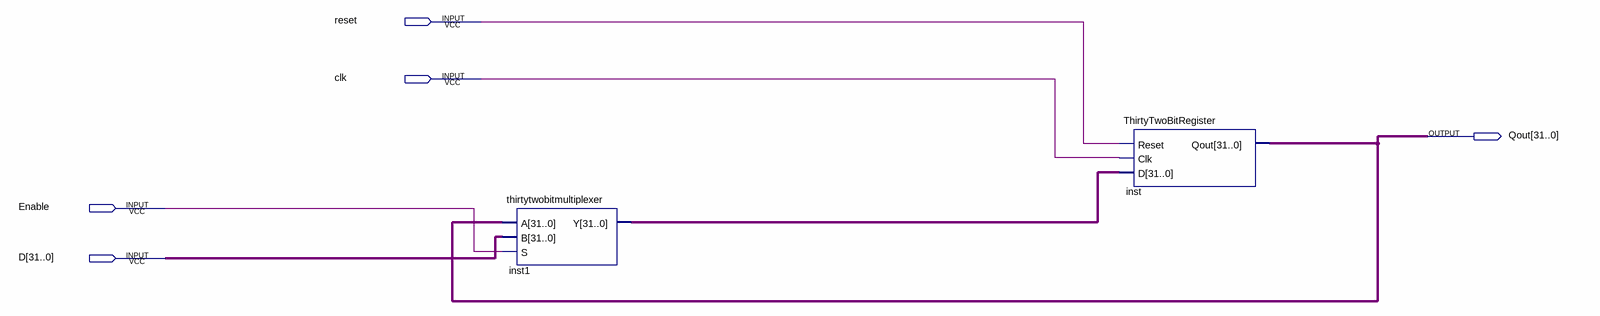
[diagram p0: schematic sheet]
// Quartus schematic thirtytwobitwithenable.bdf as structural Verilog: 2 symbols, 5 pins
module thirtytwobitwithenable (
  input  reset,
  input  clk,
  input  Enable,
  input  [31:0] D,
  output [31:0] Qout
);

  wire [31:0] inst1_y;

  thirtytwobitmultiplexer inst1 (.A(Qout), .B(D), .S(Enable), .Y(inst1_y));
  ThirtyTwoBitRegister inst (.Reset(reset), .Clk(clk), .D(inst1_y), .Qout(Qout));
endmodule
